# Altium schematic sheet Oscar_MainBoard_Power.SchDoc
size A4
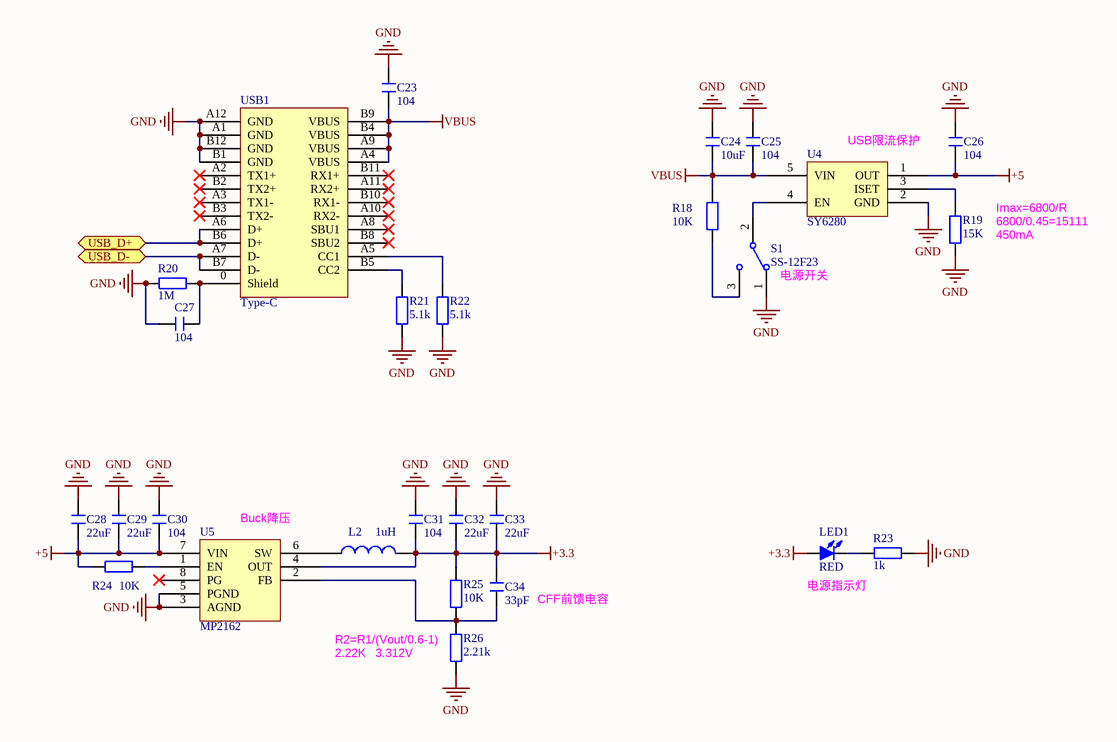
[diagram p0: Oscar_MainBoard_Power.SchDoc]

## Parts
C23  104  [C 0402_L]
C24  10uF  [C 0603_L]
C25  104  [C 0402_L]
C26  104  [C 0402_L]
C27  104  [C 0402_L]
C28  22uF  [C 0805_L]
C29  22uF  [C 0805_L]
C30  104  [C 0402_L]
C31  104  [C 0402_L]
C32  22uF  [C 0805_L]
C33  22uF  [C 0805_L]
C34  33pF  [C 0402_L]
L2  1uH  [CD32]
LED1  RED  [LED_0603]
R18  10K  [R 0402_L]
R19  15K  [R 0402_L]
R20  1M  [R 0402_L]
R21  5.1k  [R 0402_L]
R22  5.1k  [R 0402_L]
R23  1k  [R 0402_L]
R24  10K  [R 0402_L]
R25  10K  [R 0402_L]
R26  2.21k  [R 0402_L]
S1  SS-12F23  [MSK-12C01-07]
U4  SY6280  [SOT23-5N]
U5  MP2162  [QFN8]
USB1  Type-C  [USB-TYPE-C_16PIN-MALE-TYPE-C-31-M-12]

## Ports
USB_D+, USB_D-

## Nets
+3.3: C31.1 C32.1 C33.1 C34.2 L2.2 LED1.1(A) R25.1 U5.4(OUT)
+5: C26.1 C28.1 C29.1 C30.1 R24.1 U4.1(OUT) U5.7(VIN)
GND: C23.2 C24.2 C25.2 C26.2 C27.2 C28.2 C29.2 C30.2 C31.2 C32.2 C33.2 R19.2 R20.2 R21.1 R22.1 R23.2 R26.2 S1.1 U4.2(GND) U5.3(AGND) U5.5(PGND) USB1.A1(GND) USB1.A12(GND) USB1.B1(GND) USB1.B12(GND)
VBUS: C23.1 C24.1 C25.1 R18.1 U4.5(VIN) USB1.A4(VBUS) USB1.A9(VBUS) USB1.B4(VBUS) USB1.B9(VBUS)
USB_D+: USB1.A6(D+) USB1.B6(D+) ; port USB_D+
USB_D-: USB1.A7(D-) USB1.B7(D-) ; port USB_D-
NetC27_1: C27.1 R20.1 USB1.0(Shield)
NetC34_1: C34.1 R25.2 R26.1 U5.2(FB)
NetL2_1: L2.1 U5.6(SW)
NetLED1_2: LED1.2(K) R23.1
NetR18_2: R18.2 S1.3
NetR19_1: R19.1 U4.3(ISET)
NetR21_2: R21.2 USB1.B5(CC2)
NetR22_2: R22.2 USB1.A5(CC1)
NetR24_2: R24.2 U5.1(EN)
NetS1_2: S1.2 U4.4(EN)

Not connected (* = marked no-connect by the designer): U5 8(PG)*; USB1 A2(TX1+)* A3(TX1-)* A8(SBU1)* A10(RX2-)* A11(RX2+)* B2(TX2+)* B3(TX2-)* B8(SBU2)* B10(RX1-)* B11(RX1+)*

## Notes on the sheet
- (near U4) USB限流保护
- (near R19) Imax=6800/R
- (near R19) 6800/0.45=15111
- (near R19) 450mA
- (near S1) 电源开关
- (near U5) Buck降压
- (near R26) R2=R1/(Vout/0.6-1)
- (near C34) CFF前馈电容
- (near LED1) 电源指示灯
- 2.22K
- 3.312V

## Library data of the parts
C23-C34 = C: 贴片电容; BOM名称: 无极性贴片电容; 优秀评价可免费更新: 联系淘宝ID：黄晶宝石，获取更新版封装库; 卖家免费技术支持，联系售后: 唯一出售店铺网址https://shop463601444.taobao.com; 本封装库来自淘宝卖家 ID：黄晶宝石: 其他店铺购入均为盗版，请立即申请退款
L2 = L: 小功率贴片电感; 优秀评价可免费更新: 联系淘宝ID：黄晶宝石，获取更新版封装库; 卖家免费技术支持，联系售后: 唯一出售店铺网址https://shop463601444.taobao.com; 本封装库来自淘宝卖家 ID：黄晶宝石: 其他店铺购入均为盗版，请立即申请退款; BOM名称: 小功率贴片电感
LED1 = LED-SMD: 贴片LED; 优秀评价可免费更新: 联系淘宝ID：黄晶宝石，获取更新版封装库; 卖家免费技术支持，联系售后: 唯一出售店铺网址https://shop463601444.taobao.com; 封装库来自淘宝卖家 ID：黄晶宝石: 其他店铺购入均为假冒，请立即申请退款，本店奖励2~5元现金; BOM名称: 贴片LED
R18-R26 = R: 贴片电阻; 优秀评价可免费更新: 联系淘宝ID：黄晶宝石，获取更新版封装库; 卖家免费技术支持，联系售后: 唯一出售店铺网址https://shop463601444.taobao.com; 本封装库来自淘宝卖家 ID：黄晶宝石: 其他店铺购入均为盗版，请立即申请退款; BOM名称: 贴片电阻
S1 = SSW-1P: 1路波动开关; BOM名称: 波动开关; 版权归属: 封装库来自淘宝 ID：黄晶宝石; 优秀评价可免费更新: 联系淘宝ID：黄晶宝石，获取更新版封装库; 卖家免费技术支持，联系售后: 唯一出售店铺网址https://shop463601444.taobao.com; 本封装库来自淘宝卖家 ID：黄晶宝石: 其他店铺购入均为盗版，请立即申请退款
U4 = SY6280: 电源限流保护芯片
U5 = MP2162: 2.5-6v 2A buck IC